# EasyEDA Pro project wireless charger controller.eprj, board 3代
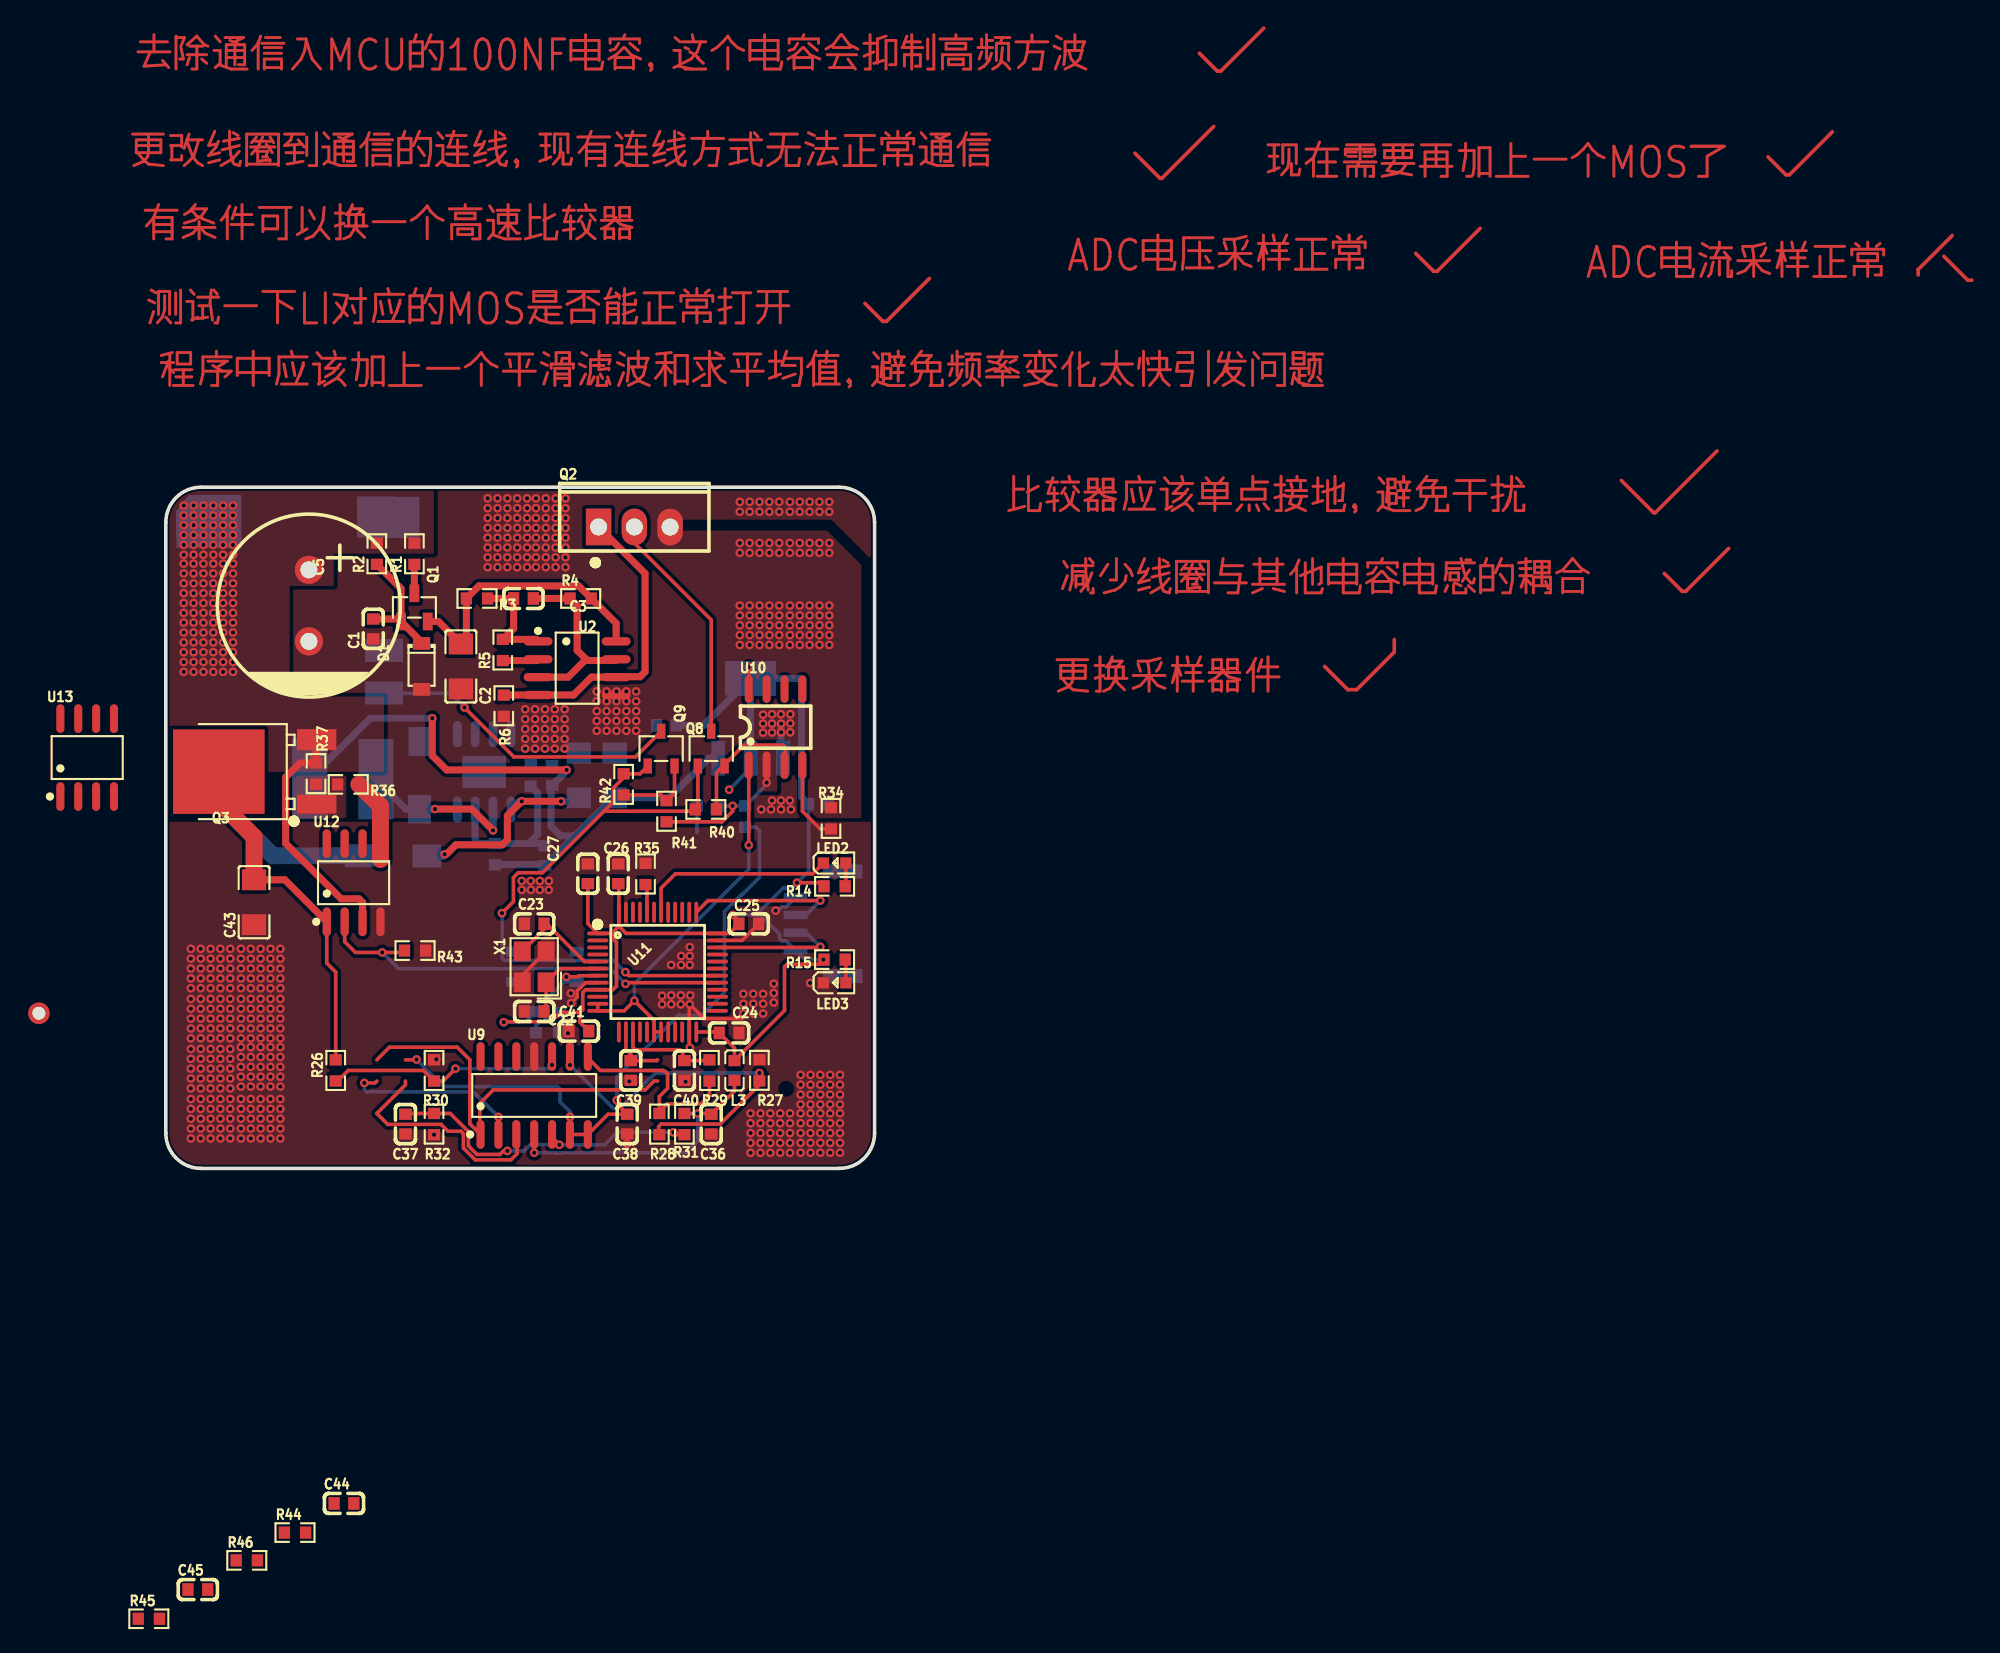
[diagram p8: board, top side]
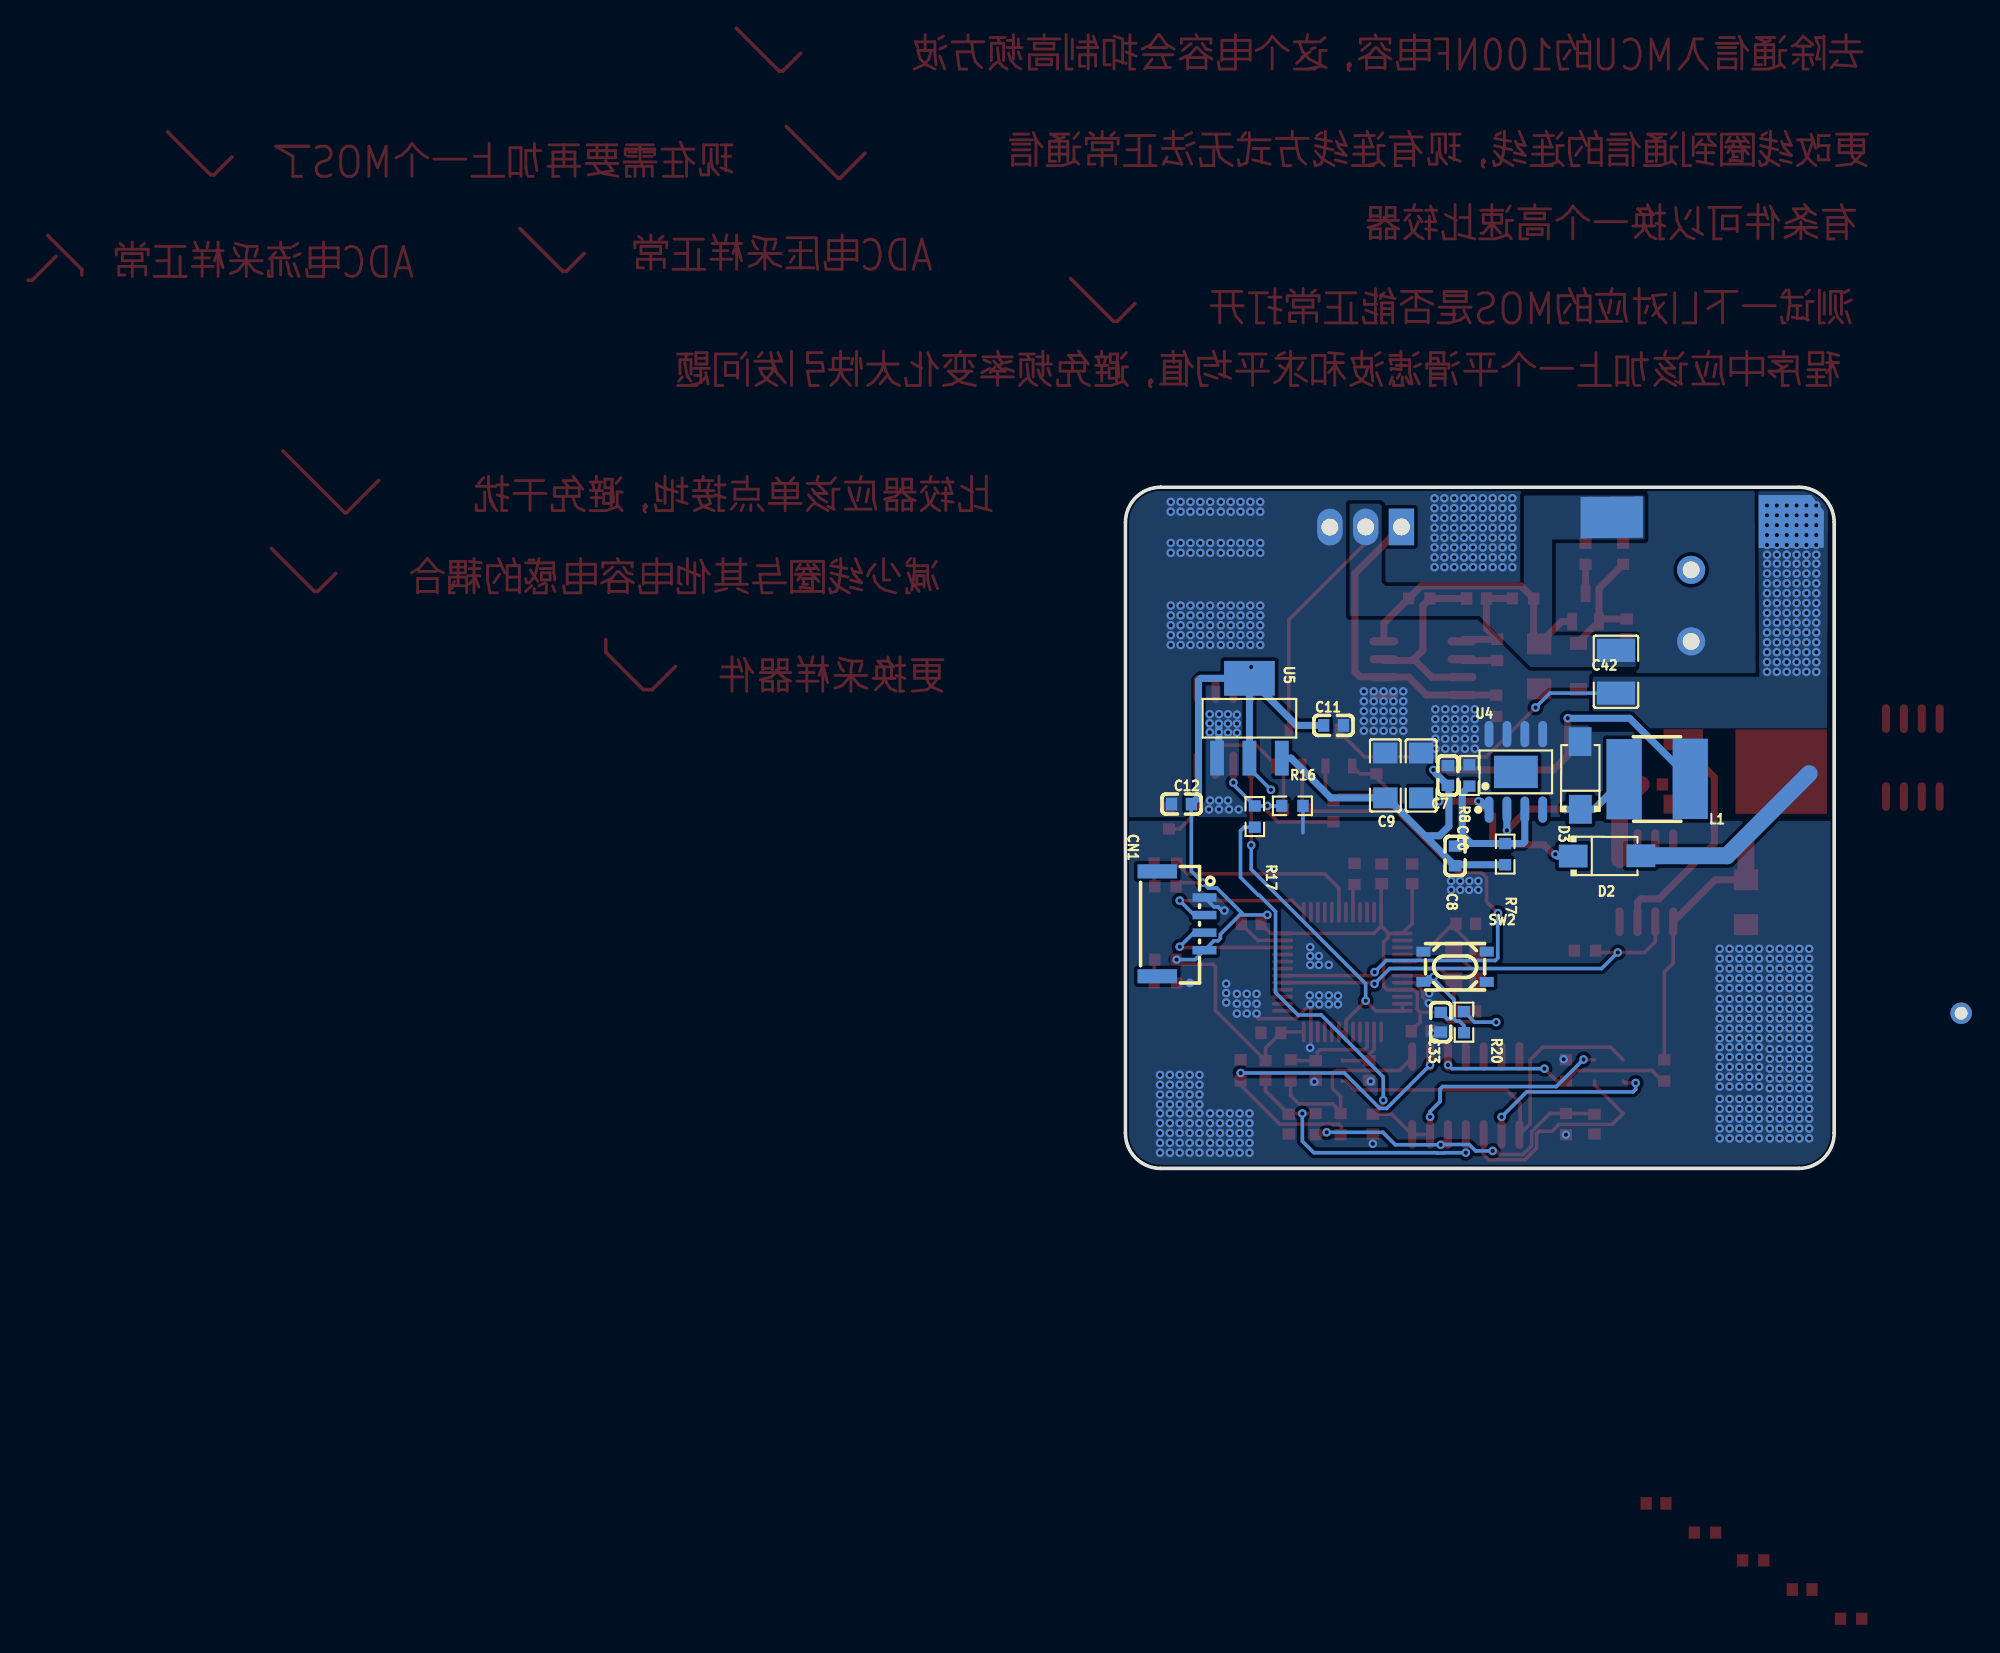
[diagram p9: board, bottom side, seen from below]

Outline 50.34 x 48.39 mm; copper layers: Top Layer, Bottom Layer. Coordinates in mm from the lower left corner of the outline.
Outline path: 0,45.89 0,2.5 arc(0.73,0.73) 2.5,0 47.84,0 arc(49.6,0.73) 50.34,2.5 50.34,45.89 arc(49.6,47.65) 47.84,48.39 2.5,48.39 arc(0.73,47.65) 0,45.89
Stack: Top Layer 0.035mm / Dielectric1 1.51mm FR4 er 4.5 / Bottom Layer 0.035mm

## Design rules (mm)
template: 自定义配置
spacing copperThickness1oz (default): track to track 0.102, other pairs 0.152 to 0.3
spacing copperThickness2oz: track to track 0.203, other pairs 0.152 to 0.3
track width copperThickness1oz (default): min 0.127, default 0.254, max 2.54
track width copperThickness2oz: min 0.203, default 0.254, max 2.54
differential pair differentialPair (default): width min 0.127, default 0.254, max 2.54; gap min 0.152, default 0.152
via viaSize (default): diameter min 0.5, default 0.61, max 10; hole min 0.3, default 0.305, max 6.3
net WGND uses copperRegion1
net +9.5V uses copperRegion1
net $1N7036 uses copperRegion1
net GND uses copperRegion1
net $1N7004 uses copperRegion1
net +36V uses copperRegion1
net GH uses copperRegion1
net HS uses copperRegion1
net INFORMATION+ uses copperRegion1
net $1N27675 uses copperRegion1
net LOAD- uses copperRegion1

## Placement (name value [footprint] x y rotation side)
C1  100nF  [C0603]  14.73 38.33 90 top
C2  47uF  [C1206]  20.95 35.66 90 top
C3  1nF  [C0603]  25.4 40.49 180 top
C5  1000uF  [CAP-TH_BD13.0-P5.00-D1.2-FD]  10.16 39.98 270 top
C7  10uF  [C1206]  29.34 27.91 270 bottom
C8  33nF  [C0603]  26.92 22.2 90 bottom
C9  47uF  [C1206]  31.88 27.91 90 bottom
C10  100nF  [C0603]  27.43 27.91 90 bottom
C11  10uF  [C0603]  35.56 31.47 180 bottom
C12  100nF  [C0603]  46.35 25.88 0 bottom
C22  22pF  [C0603]  26.16 11.15 180 top
C23  22pF  [C0603]  26.16 17.37 0 top
C24  100nF  [C0603]  40 9.62 0 top
C25  100nF  [C0603]  41.4 17.37 0 top
C26  100nF  [C0603]  32.13 20.93 90 top
C27  100nF  [C0603]  29.97 20.93 90 top
C33  100nF  [C0603]  27.94 10.39 90 bottom
C36  100nF  [C0603]  38.73 3.15 90 top
C37  100nF  [C0603]  17.02 3.15 90 top
C38  100nF  [C0603]  32.77 3.15 90 top
C39  10nF  [C0603]  33.02 6.96 90 top
C40  10nF  [C0603]  36.83 6.96 270 top
C41  100nF  [C0603]  29.34 9.75 0 top
C42  47nF  [C1210]  15.49 35.28 270 bottom
C43  10uF  [C1206]  6.26 18.91 90 top
C44  100nF  [C0603]  12.65 -23.8 0 top
C45  10nF  [C0603]  2.27 -29.92 0 top
CN1  ZX-BX-GH1.25-LT4  [CONN-SMD_ZX-BX-GH1.25-LT4]  46.4 17.37 270 bottom
D1  MMSZ5242B  [SOD-123_L2.7-W1.6-LS3.7-RD]  18.16 35.66 270 top
D2  SS510  [SMA_L4.3-W2.6-LS5.0-RD]  16.13 22.2 180 bottom
D3  SS510  [SMA_L4.3-W2.6-LS5.0-RD]  18.03 27.91 90 bottom
L1  100uH  [IND-SMD_L6.0-W6.0_FNR60XXS]  12.57 27.66 0 bottom
L3  10uH  [L0603]  40.39 6.96 90 top
LED2  NCD0603R1  [LED0603-RD_RED]  47.5 21.69 0 top
LED3  NCD0603R1  [LED0603-RD_RED]  47.5 13.18 0 top
NOREF  -  [Pad_e851]  3.05 45.95 0 top
NOREF#2  -  [Pad_e852]  15.8 46.25 0 top
NOREF#3  -  [Pad_e608]  3.05 45.96 0 top
NOREF#4  -  [Pad_e622]  -9.02 11.02 0 top
Q1  MMBT5551  [SOT-23-3_L2.9-W1.3-P1.90-LS2.4-BR]  17.65 39.85 270 top
Q2  -  [IRF9540P_TO-220]  33.27 45.57 0 top
Q3  NCEP0178AK  [TO-252-2_L6.5-W6.1-P4.58-LS10.0-TL]  7.24 28.17 180 top
Q8  G01N20LE  [SOT-23-3_L2.9-W1.6-P1.90-LS2.8-BR]  38.73 29.82 270 top
Q9  G01N20LE  [SOT-23-3_L2.9-W1.6-P1.90-LS2.8-BR]  35.18 29.82 270 top
R1  330Ω  [R0603]  17.65 43.66 90 top
R2  100kΩ  [R0603]  14.99 43.66 90 top
R3  47kΩ  [R0603]  22.1 40.49 180 top
R4  47kΩ  [R0603]  29.46 40.49 0 top
R5  3.9kΩ  [R0603]  23.93 36.83 90 top
R6  20kΩ  [R0603]  24 32.87 90 top
R7  30kΩ  [R0603]  23.37 22.32 90 bottom
R8  4.7kΩ  [R0603]  25.91 27.91 270 bottom
R14  1kΩ  [R0603]  47.5 20.04 180 top
R15  1kΩ  [R0603]  47.5 14.83 180 top
R16  0Ω  [R0603]  38.48 25.75 0 bottom
R17  0Ω  [R0603]  41.15 24.99 90 bottom
R20  10kΩ  [R0603]  26.29 10.39 90 bottom
R26  15kΩ  [R0603]  12.06 6.96 90 top
R27  15kΩ  [R0603]  42.16 6.97 90 top
R28  1kΩ  [R0603]  35.05 3.15 270 top
R29  1kΩ  [R0603]  38.61 6.96 90 top
R30  1kΩ  [R0603]  19.05 6.96 90 top
R31  10kΩ  [R0603]  36.83 3.15 270 top
R32  10kΩ  [R0603]  19.05 3.15 270 top
R34  0Ω  [R0603]  47.24 24.86 90 top
R35  10kΩ  [R0603]  34.07 20.91 90 top
R36  4.7Ω  [R0603]  12.95 27.28 180 top
R37  10kΩ  [R0603]  10.67 28.04 270 top
R40  10kΩ  [R0603]  38.35 25.5 180 top
R41  0Ω  [R0603]  35.56 25.37 270 top
R42  10kΩ  [R0603]  32.51 27.28 90 top
R43  10kΩ  [R0603]  17.7 15.47 180 top
R44  100Ω  [R0603]  9.17 -25.87 0 top
R45  100Ω  [R0603]  -1.21 -31.99 0 top
R46  10kΩ  [R0603]  5.75 -27.85 0 top
SW2  TS3425BA  [SW-SMD_4P-L4.2-W3.2-P2.15-LS4.6-1]  26.92 14.32 0 bottom
U2  LM2904DR2G  [SOIC-8_L4.9-W3.9-P1.27-LS6.0-BL]  29.21 35.53 270 top
U4  XL7005A  [SOIC-8_L4.9-W3.9-P1.27-LS6.0-BL-EP3.1-1]  22.61 28.17 180 bottom
U5  SPX1117M3-L-3-3/TR  [SOT-223-4_L6.5-W3.5-P2.30-LS7.0-BR]  41.53 31.98 270 bottom
U9  TLV2374IDR  [SOIC-14_L8.7-W3.9-P1.27-LS6.0-BL]  26.16 5.18 0 top
U10  LM393DR  [SOIC-8_L5.0-W4.0-P1.27-LS6.0-BL]  43.31 31.34 0 top
U11  STM32F103C8T6  [LQFP-48_L7.0-W7.0-P0.50-LS9.0-BL]  34.92 13.94 270 top
U12  MX5014S  [SOIC-8_L4.9-W3.9-P1.27-LS6.0-BL]  13.34 20.29 0 top
U13  CC6920BSO-10A  [SOP-8_L5.0-W4.0-P1.27-LS6.0-BL]  -5.59 29.18 0 top
X1  8MHz  [CRYSTAL-SMD_4P-L3.2-W2.5-BL]  26.16 14.32 90 top

## Footprints (pads in the part's own frame, mm; a bottom-side part is the same pattern mirrored in y, then rotated)
C0603
  rect 0.8x0.9 smd: 1(-0.7,0) 2(0.7,0)
C1206
  rect 1.485x1.728 smd: 1(-1.593,0) 2(1.593,0)
C1210
  rect 1.635x2.7 smd: 1(-1.518,0) 2(1.518,0)
CAP-TH_BD13.0-P5.00-D1.2-FD
  round 2 hole 1.2: 1(-2.54,0) 2(2.54,0)
CONN-SMD_ZX-BX-GH1.25-LT4
  rect 0.6x1.7 smd: 1(-1.875,1.675) 2(-0.625,1.675) 3(0.625,1.675) 4(1.875,1.675)
  rect 1x2.8 smd: 5(3.725,-1.675) 6(-3.725,-1.675)
CRYSTAL-SMD_4P-L3.2-W2.5-BL
  rect 1.4x1.2 smd: 1(-1.1,-0.85) 2(1.1,-0.85) 3(1.1,0.85) 4(-1.1,0.85)
IND-SMD_L6.0-W6.0_FNR60XXS
  rect 2.5x5.7 smd: 1(-2.35,-0.013) 2(2.35,0.013)
IRF9540P_TO-220
  rect 1.801x2.601 hole 1.199: 1(-2.54,0)
  oval 1.801x2.601 hole 1.199: 2(0,0) 3(2.54,-0.01)
L0603
  rect 0.8x0.864 smd: 1(-0.7,0) 2(0.7,0)
LED0603-RD_RED
  rect 0.8x0.8 smd: 1(-0.799,-0.004) 2(0.799,0.004)
LQFP-48_L7.0-W7.0-P0.50-LS9.0-BL
  oval 0.27x1.5 smd: 1(-2.75,-4.25) 2(-2.25,-4.25) 3(-1.75,-4.25) 4(-1.25,-4.25) 5(-0.75,-4.25) 6(-0.25,-4.25) 7(0.25,-4.25) 8(0.75,-4.25) 9(1.25,-4.25) 10(1.75,-4.25) 11(2.25,-4.25) 12(2.75,-4.25) 25(2.75,4.25) 26(2.25,4.25) 27(1.75,4.25) 28(1.25,4.25) 29(0.75,4.25) 30(0.25,4.25) 31(-0.25,4.25) 32(-0.75,4.25) 33(-1.25,4.25) 34(-1.75,4.25) 35(-2.25,4.25) 36(-2.75,4.25)
  oval 1.5x0.27 smd: 13(4.25,-2.75) 14(4.25,-2.25) 15(4.25,-1.75) 16(4.25,-1.25) 17(4.25,-0.75) 18(4.25,-0.25) 19(4.25,0.25) 20(4.25,0.75) 21(4.25,1.25) 22(4.25,1.75) 23(4.25,2.25) 24(4.25,2.75) 37(-4.25,2.75) 38(-4.25,2.25) 39(-4.25,1.75) 40(-4.25,1.25) 41(-4.25,0.75) 42(-4.25,0.25) 43(-4.25,-0.25) 44(-4.25,-0.75) 45(-4.25,-1.25) 46(-4.25,-1.75) 47(-4.25,-2.25) 48(-4.25,-2.75)
Pad_e608
  custom 4.61x3.735 smd far side: 1(0,0)
Pad_e622
  round 1.524 hole 0.914: 1(0,0)
Pad_e851
  custom 4.61x3.735 smd far side: 1(0,0)
Pad_e852
  custom 4.419x2.974 smd far side: 2(0,0)
R0603
  rect 0.806x0.864 smd: 1(-0.753,0) 2(0.753,0)
SMA_L4.3-W2.6-LS5.0-RD
  rect 2.046x1.62 smd: 1(-2.404,-0.009) 2(2.404,0.009)
SOD-123_L2.7-W1.6-LS3.7-RD
  rect 0.91x1.22 smd: 1(-1.635,0) 2(1.635,0)
SOIC-8_L4.9-W3.9-P1.27-LS6.0-BL
  oval 0.588x2.045 smd: 1(-1.905,-2.772) 2(-0.635,-2.772) 3(0.635,-2.772) 4(1.905,-2.772) 5(1.905,2.772) 6(0.635,2.772) 7(-0.635,2.772) 8(-1.905,2.772)
SOIC-8_L4.9-W3.9-P1.27-LS6.0-BL-EP3.1-1
  oval 0.63x1.865 smd: 1(-1.905,-2.683) 2(-0.635,-2.683) 3(0.635,-2.683) 4(1.905,-2.683) 5(1.905,2.683) 6(0.635,2.683) 7(-0.635,2.683) 8(-1.905,2.683)
  rect 3.1x2.3 smd: 9(0,0)
SOIC-8_L5.0-W4.0-P1.27-LS6.0-BL
  oval 0.569x1.95 smd: 1(-1.905,-2.705) 2(-0.635,-2.705) 3(0.635,-2.705) 4(1.905,-2.705) 5(1.905,2.705) 6(0.635,2.705) 7(-0.635,2.705) 8(-1.905,2.705)
SOIC-14_L8.7-W3.9-P1.27-LS6.0-BL
  oval 0.574x2.038 smd: 1(-3.81,-2.769) 2(-2.54,-2.769) 3(-1.27,-2.769) 4(0,-2.769) 5(1.27,-2.769) 6(2.54,-2.769) 7(3.81,-2.769) 8(3.81,2.769) 9(2.54,2.769) 10(1.27,2.769) 11(0,2.769) 12(-1.27,2.769) 13(-2.54,2.769) 14(-3.81,2.769)
SOP-8_L5.0-W4.0-P1.27-LS6.0-BL
  oval 0.574x2.035 smd: 1(-1.905,-2.768) 2(-0.635,-2.768) 3(0.635,-2.768) 4(1.905,-2.768) 5(1.905,2.768) 6(0.635,2.768) 7(-0.635,2.768) 8(-1.905,2.768)
SOT-23-3_L2.9-W1.3-P1.90-LS2.4-BR
  rect 1.25x0.7 smd: 1(1,-0.95) 2(1,0.95) 3(-1,0)
SOT-23-3_L2.9-W1.6-P1.90-LS2.8-BR
  rect 1.07x0.6 smd: 1(1.235,-0.95) 2(1.235,0.95) 3(-1.235,0)
SOT-223-4_L6.5-W3.5-P2.30-LS7.0-BR
  rect 2.47x0.98 smd: 1(2.835,-2.3) 2(2.835,0) 3(2.835,2.3)
  rect 2.47x3.6 smd: 4(-2.835,0)
SW-SMD_4P-L4.2-W3.2-P2.15-LS4.6-1
  rect 1x0.7 smd: 1(-2.25,1.075) 2(2.25,1.075) 3(-2.25,-1.075) 4(2.25,-1.075)
TO-252-2_L6.5-W6.1-P4.58-LS10.0-TL
  rect 2.8x1.35 smd: 1(-3.475,2.29)
  rect 2.8x1.5 smd: 3(-3.475,-2.29)
  rect 6.5x6 smd: 4(3.475,-0.017)

## Nets
As in the schematic, except:
HS: C5.1 C42.2 NOREF.1 NOREF#3.1 Q3.3 Q9.3 R1.2 R2.2 R37.1 U12.3
INFORMATION+: C42.1 NOREF#2.2 Q2.2 Q8.3

Pads without a net: CN1 5 6; NOREF#4 1; SW2 1 3; U4 4 9; U9 12 13 14; U10 5 6 7; U11 2 3 4 10 13 16 17 20 21 22 25 26 27 28 31 32 33 38 39 40 41 43 45 46; U12 6 7 8; U13 6

## Via types
v1: diameter 0.61, hole 0.305, Top Layer to Bottom Layer, 693 vias

## Routing (per net, layer and track width the routed paths; a pad name or vN(x,y) marks a point on that pad's centre or on a via; arc(x,y) is an arc through that point)
36V: length 40.2
  Top Layer w0.254: U12.1 11.43,14.58 12.06,13.94 12.06,7.71
  Top Layer w0.5: U12.1 8.45,20.5 C43.2
  Top Layer w1.2: 1.78,28.04 6.26,23.55 C43.2
  Bottom Layer w1.2: 1.78,28.04 7.61,22.21 D2.2
+1.65V: length 45.6
  Top Layer w0.254: v1(32.02,4.84) 32.02,4.59 C38.2 31.41,3.85 U9.7 U9.6 ; 17.02,7.71 17.78,7.71 v1(17.81,7.74)
  Bottom Layer w0.254: v1(28.7,3.66) 28.7,4.04 27.99,4.75 27.99,5.63 27.81,5.81 19.73,5.81 v1(17.81,7.74) ; v1(32.02,4.84) 32.02,6.5 36.42,10.89 38.07,10.89 39.67,12.5 39.67,18.25 40.83,19.4 40.89,19.4 42.16,20.67 42.16,23.98 41.9,24.24 R17.1
+3.3V: length 100.6
  Top Layer w0.254: 29.41,11.08 28.04,11.08 27.38,10.42 24.04,10.42 v1(24,10.39) ; 29.41,11.08 29.61,11.28 29.61,12.49 29.81,12.69 U11.9 31.75,12.69 32,12.95 32,16.06 31.67,16.4 31.67,16.69 ; 29.41,11.08 29.41,10.38 C41.2 ; R14.2 46.49,20.29 v1(44.83,20.29) ; C26.1 32.17,20.18 U11.48 32.17,17.2 ; 32.17,17.2 32.68,16.69 U11.36 40.02,16.69 C25.1 40.7,17.56 v1(40.26,18.01) ; 32.17,17.2 31.67,16.69 ; U11.24 39.24,9.69 C24.1 40.39,8.54 L3.2 43.94,11.21 43.94,14.32 44.12,14.5 46.42,14.5 R15.2 ; v1(41.4,35.62) U10.8 ; C27.1 29.97,17.4 U11.1 31.67,16.69
  Bottom Layer w0.254: R20.2 25.54,10.39 v1(24,10.39) ; 41.94,18.01 42.21,18.01 43.59,16.63 43.59,16.33 43.76,16.17 44.05,16.17 CN1.4 45.39,14.83 v1(46.7,14.83) ; 41.94,18.01 v1(40.26,18.01) ; 41.94,18.01 43.84,19.91 44.45,19.91 v1(44.83,20.29) 45.66,21.12 C12.1 ; v1(40,26.9) 41.53,28.42 U5.2
  Bottom Layer w0.5: C12.1 45.15,26.39 45.15,34.64 44.98,34.81 U5.4 ; U5.4 38.19,31.47 C11.1 ; U5.4 U5.2
+9.5V: length 48.6
  Top Layer w0.5: v1(28.47,28.31) 19.94,28.31 18.92,29.33 v1(18.92,31.98)
  Bottom Layer w0.5: v1(18.92,31.98) 14.53,31.98 L1.1 ; 29.06,23.63 31.75,26.32 35.75,26.32 38.57,29.14 U5.3 ; 29.06,23.63 28.03,23.63 27.36,24.3 27.36,27.14 C10.1 27.62,27.4 27.64,27.4 28.28,28.05 28.28,28.12 v1(28.47,28.31) ; 29.06,23.63 27.78,22.35 27.78,22.33 26.94,21.5 C8.1 26.85,21.57 R7.1
GND: length 27.1
  Top Layer w0.254: 41.07,11 40.89,10.82 40.89,10.64 38.23,10.64 v1(37.21,11.66) 37.17,11.62 U11.23 37.17,8.62 v1(37.22,8.57) ; C39.1 32.95,6.18 v1(32.92,6.18) ; C38.1 v1(32.77,1.75) ; U11.8 29.81,13.19 29.21,12.6 29.21,12.17 v1(28.78,11.74) ; U11.35 40.92,16.19 C25.2 ; X1.2 25.31,13.72 X1.4 ; R34.1 46.47,24.11 45.21,25.37 U10.4
  Bottom Layer w0.254: v1(43.31,18.31) 43.49,18.31 43.76,18.58 44.05,18.58 CN1.1 ; 37.73,23.85 R16.1
  vias: v1(1.77,15.6) v1(1.77,14.9) v1(1.77,14.2) v1(1.77,13.5) v1(1.77,12.8) v1(1.77,12.04) v1(1.77,11.34) v1(1.77,10.64) v1(1.77,9.94) v1(1.77,9.24) v1(1.77,8.48) v1(1.77,7.78) v1(1.77,7.08) v1(1.77,6.38) v1(1.77,5.68) v1(1.77,4.93) v1(1.77,4.23) v1(1.77,3.53) v1(1.77,2.83) v1(1.77,2.13) v1(2.47,15.6) v1(2.47,14.9) v1(2.47,14.2) v1(2.47,13.5) v1(2.47,12.8) v1(2.47,12.04) v1(2.47,11.34) v1(2.47,10.64) v1(2.47,9.94) v1(2.47,9.24) v1(2.47,8.48) v1(2.47,7.78) v1(2.47,7.08) v1(2.47,6.38) v1(2.47,5.68) v1(2.47,4.93) v1(2.47,4.23) v1(2.47,3.53) v1(2.47,2.83) v1(2.47,2.13) v1(3.17,15.6) v1(3.17,14.9) v1(3.17,14.2) v1(3.17,13.5) v1(3.17,12.8) v1(3.17,12.04) v1(3.17,11.34) v1(3.17,10.64) v1(3.17,9.94) v1(3.17,9.24) v1(3.17,8.48) v1(3.17,7.78) v1(3.17,7.08) v1(3.17,6.38) v1(3.17,5.68) v1(3.17,4.93) v1(3.17,4.23) v1(3.17,3.53) v1(3.17,2.83) v1(3.17,2.13) v1(3.88,15.6) v1(3.88,14.9) v1(3.88,14.2) v1(3.88,13.5) v1(3.88,12.8) v1(3.88,12.04) v1(3.88,11.34) v1(3.88,10.64) v1(3.88,9.94) v1(3.88,9.24) v1(3.88,8.48) v1(3.88,7.78) v1(3.88,7.08) v1(3.88,6.38) v1(3.88,5.68) v1(3.88,4.93) v1(3.88,4.23) v1(3.88,3.53) v1(3.88,2.83) v1(3.88,2.13) v1(4.57,15.6) v1(4.57,14.9) v1(4.57,14.2) v1(4.57,13.5) v1(4.57,12.8) v1(4.57,12.04) v1(4.57,11.34) v1(4.57,10.64) v1(4.57,9.94) v1(4.57,9.24) v1(4.57,8.48) v1(4.57,7.78) v1(4.57,7.08) v1(4.57,6.38) v1(4.57,5.68) v1(4.57,4.93) v1(4.57,4.23) v1(4.57,3.53) v1(4.57,2.83) v1(4.57,2.13) v1(5.33,15.6) v1(5.33,14.9) v1(5.33,14.2) v1(5.33,13.5) v1(5.33,12.8) v1(5.33,12.04) v1(5.33,11.34) v1(5.33,10.64) v1(5.33,9.94) v1(5.33,9.24) v1(5.33,8.61) v1(5.33,7.91) v1(5.33,7.21) v1(5.33,6.51) v1(5.33,5.81) v1(5.33,4.93) v1(5.33,4.23) v1(5.33,3.53) v1(5.33,2.83) v1(5.33,2.13) v1(6.03,15.6) v1(6.03,14.9) v1(6.03,14.2) v1(6.03,13.5) v1(6.03,12.8) v1(6.03,12.04) v1(6.03,11.34) v1(6.03,10.64) v1(6.03,9.94) v1(6.03,9.24) v1(6.03,8.61) v1(6.03,7.91) v1(6.03,7.21) v1(6.03,6.51) v1(6.03,5.81) v1(6.03,4.93) v1(6.03,4.23) v1(6.03,3.53) v1(6.03,2.83) v1(6.03,2.13) v1(6.73,15.6) v1(6.73,14.9) v1(6.73,14.2) v1(6.73,13.5) v1(6.73,12.8) v1(6.73,12.04) v1(6.73,11.34) v1(6.73,10.64) v1(6.73,9.94) v1(6.73,9.24) v1(6.73,8.61) v1(6.73,7.91) v1(6.73,7.21) v1(6.73,6.51) v1(6.73,5.81) v1(6.73,4.93) v1(6.73,4.23) v1(6.73,3.53) v1(6.73,2.83) v1(6.73,2.13) v1(7.43,15.6) v1(7.43,14.9) v1(7.43,14.2) v1(7.43,13.5) v1(7.43,12.8) v1(7.43,12.04) v1(7.43,11.34) v1(7.43,10.64) v1(7.43,9.94) v1(7.43,9.24) v1(7.43,8.61) v1(7.43,7.91) v1(7.43,7.21) v1(7.43,6.51) v1(7.43,5.81) v1(7.43,4.93) v1(7.43,4.23) v1(7.43,3.53) v1(7.43,2.83) v1(7.43,2.13) v1(8.13,15.6) v1(8.13,14.9) v1(8.13,14.2) v1(8.13,13.5) v1(8.13,12.8) v1(8.13,12.04) v1(8.13,11.34) v1(8.13,10.64) v1(8.13,9.94) v1(8.13,9.24) v1(8.13,8.61) v1(8.13,7.91) v1(8.13,7.21) v1(8.13,6.51) v1(8.13,5.81) v1(8.13,4.93) v1(8.13,4.23) v1(8.13,3.53) v1(8.13,2.83) v1(8.13,2.13) v1(19.05,2.39) v1(19.21,7.75) v1(25.27,20.42) v1(25.27,19.78) v1(25.91,20.42) v1(25.92,19.78) v1(26.56,20.42) v1(26.56,19.78) v1(27.21,20.42) v1(27.2,19.78) v1(28.56,9.6) v1(28.76,12.44) v1(35.24,12.26) v1(35.24,11.66) v1(35.89,14.45) v1(35.89,12.29) v1(35.89,11.66) v1(36.6,15.09) v1(36.59,14.45) v1(36.58,12.29) v1(36.58,11.66) v1(36.92,6.16) v1(37.21,15.72) v1(37.21,15.09) v1(37.21,14.45) v1(37.24,12.29) v1(41.02,12.4) v1(41.02,11.7) v1(41.02,11) v1(41.53,3.91) v1(41.53,3.21) v1(41.53,2.51) v1(41.53,1.81) v1(41.53,1.11) v1(41.72,12.4) v1(41.72,11.7) v1(41.72,11) v1(42.23,3.91) v1(42.23,3.21) v1(42.23,2.51) v1(42.23,1.81) v1(42.23,1.11) v1(42.42,12.4) v1(42.42,11.7) v1(42.42,11) v1(42.93,3.91) v1(42.93,3.21) v1(42.93,2.51) v1(42.93,1.81) v1(42.93,1.11) v1(43.18,13.12) v1(43.18,12.46) v1(43.18,11.78) v1(43.63,3.91) v1(43.63,3.21) v1(43.63,2.51) v1(43.63,1.81) v1(43.63,1.11) v1(44.33,3.91) v1(44.33,3.21) v1(44.33,2.51) v1(44.33,1.81) v1(44.33,1.11) v1(45.08,6.64) v1(45.08,5.94) v1(45.08,5.24) v1(45.08,4.54) v1(45.08,3.91) v1(45.08,3.21) v1(45.08,2.51) v1(45.08,1.81) v1(45.08,1.11) v1(45.76,13.17) v1(45.78,6.64) v1(45.78,5.94) v1(45.78,5.24) v1(45.78,4.54) v1(45.78,3.91) v1(45.78,3.21) v1(45.78,2.51) v1(45.78,1.81) v1(45.78,1.11) v1(46.48,6.64) v1(46.48,5.94) v1(46.48,5.24) v1(46.48,4.54) v1(46.48,3.91) v1(46.48,3.21) v1(46.48,2.51) v1(46.48,1.81) v1(46.48,1.11) v1(47.18,6.64) v1(47.18,5.94) v1(47.18,5.24) v1(47.18,4.54) v1(47.18,3.91) v1(47.18,3.21) v1(47.18,2.51) v1(47.18,1.81) v1(47.18,1.11) v1(47.88,6.64) v1(47.88,5.94) v1(47.88,5.24) v1(47.88,4.54) v1(47.88,3.91) v1(47.88,3.21) v1(47.88,2.51) v1(47.88,1.81) v1(47.88,1.11)
(no net): length 63.3
  Top Layer w0.254: 106.43,42.26 107.7,40.99 107.95,40.99 111,44.04 ; 73.41,79.22 74.68,77.95 74.93,77.95 77.98,81 ; 103.38,48.87 105.66,46.58 105.79,46.58 110.17,50.96 ; 87.25,37.56 87.25,36.68 84.58,34.01 83.95,34.01 82.3,35.66 ; 88.77,65 90.04,63.73 90.3,63.73 93.34,66.77 ; 126.87,66.27 124.46,63.85 124.46,63.47 ; 128.27,63.09 127.98,63.09 126.28,64.79 ; 113.79,71.85 115.06,70.58 115.32,70.58 118.36,73.63 ; 49.66,61.44 50.93,60.17 51.18,60.17 54.23,63.22 ; 74.42,74.01 70.74,70.33 70.61,70.33 68.83,72.11
BOOT0: length 2
  Top Layer w0.254: R35.1 34.17,20.05 U11.44
GH: length 6
  Top Layer w1.2: R36.1 15.24,25.74 U12.5 15.24,21.94
HS: length 39.8
  Top Layer w0.254: Q9.3 33.36,29.23 24.72,29.23 v1(21.21,32.74)
  Top Layer w0.5: Q3.3 10.67,30.41 R37.1 9.52,28.79 8.51,27.79 8.51,23.09 12.45,19.15 13.72,19.15 13.97,18.9 U12.3
  Bottom Layer w0.254: C42.2 20.19,33.76 v1(21.21,32.74)
  vias: v1(1.27,47.09) v1(1.27,46.39) v1(1.27,45.69) v1(1.27,44.99) v1(1.27,44.29) v1(1.27,43.59) v1(1.27,42.96) v1(1.27,42.26) v1(1.27,41.56) v1(1.27,40.86) v1(1.27,40.16) v1(1.27,39.46) v1(1.27,38.77) v1(1.27,38.07) v1(1.27,37.37) v1(1.27,36.67) v1(1.27,35.97) v1(1.27,35.27) v1(1.97,47.09) v1(1.97,46.39) v1(1.97,45.69) v1(1.97,44.99) v1(1.97,44.29) v1(1.97,43.59) v1(1.97,42.96) v1(1.97,42.26) v1(1.97,41.56) v1(1.97,40.86) v1(1.97,40.16) v1(1.97,39.46) v1(1.97,38.77) v1(1.97,38.07) v1(1.97,37.37) v1(1.97,36.67) v1(1.97,35.97) v1(1.97,35.27) v1(2.67,47.09) v1(2.67,46.39) v1(2.67,45.69) v1(2.67,44.99) v1(2.67,44.29) v1(2.67,43.59) v1(2.67,42.96) v1(2.67,42.26) v1(2.67,41.56) v1(2.67,40.86) v1(2.67,40.16) v1(2.67,39.46) v1(2.67,38.77) v1(2.67,38.07) v1(2.67,37.37) v1(2.67,36.67) v1(2.67,35.97) v1(2.67,35.27) v1(3.37,47.09) v1(3.37,46.39) v1(3.37,45.69) v1(3.37,44.99) v1(3.37,44.29) v1(3.37,43.59) v1(3.37,42.96) v1(3.37,42.26) v1(3.37,41.56) v1(3.37,40.86) v1(3.37,40.16) v1(3.37,39.46) v1(3.37,38.77) v1(3.37,38.07) v1(3.37,37.37) v1(3.37,36.67) v1(3.37,35.97) v1(3.37,35.27) v1(4.07,47.09) v1(4.07,46.39) v1(4.07,45.69) v1(4.07,44.99) v1(4.07,44.29) v1(4.07,43.59) v1(4.07,42.96) v1(4.07,42.26) v1(4.07,41.56) v1(4.07,40.86) v1(4.07,40.16) v1(4.07,39.46) v1(4.07,38.77) v1(4.07,38.07) v1(4.07,37.37) v1(4.07,36.67) v1(4.07,35.97) v1(4.07,35.27) v1(4.77,47.09) v1(4.77,46.39) v1(4.77,45.69) v1(4.77,44.99) v1(4.77,44.29) v1(4.77,43.59) v1(4.77,42.96) v1(4.77,42.26) v1(4.77,41.56) v1(4.77,40.86) v1(4.77,40.16) v1(4.77,39.46) v1(4.77,38.77) v1(4.77,38.07) v1(4.77,37.37) v1(4.77,36.67) v1(4.77,35.97) v1(4.77,35.27)
I_DETC: length 4.1
  Top Layer w0.254: U11.14 32.67,8.45 33.02,8.1 C39.2 34.87,7.66 34.92,7.71
INFORMATION+: length 17.1
  Top Layer w0.254: Q2.2 33.27,44.42 38.73,38.96 38.73,30.69
MCUIN: length 26.8
  Top Layer w0.254: v1(41.4,22.96) U10.1 ; U11.11 U11.12 32.56,11.19 v1(33.27,11.91) 34.67,10.51 U11.18 U11.19
  Bottom Layer w0.254: v1(33.27,11.91) 33.27,13.12 41.4,21.25 v1(41.4,22.96)
NET1: length 9
  Top Layer w0.5: C1.2 16.53,39.03 Q1.1 ; Q1.1 16.7,41.19 R2.1 ; Q1.1 18.16,37.39 D1.1
NET2: length 19.8
  Top Layer w0.5: U2.8 31.98,38.72 R4.2 29.33,41.37 22.23,41.37 R3.2 21.34,37.64 C2.2 19.36,38.85 Q1.2
NET3: length 2.1
  Top Layer w0.5: Q1.3 R1.1
OSCIN: length 7.5
  Top Layer w0.254: U11.5 29.73,14.69 27.05,17.37 C23.2 26.86,16.97 X1.3
OSCOUT: length 6.2
  Top Layer w0.254: C22.1 27.01,11.3 X1.1 27.98,14.19 U11.6
PA8(HI): length 30.8
  Top Layer w0.254: R43.2 16.81,15.34 v1(15.37,15.34) 13.46,15.34 12.7,16.1 U12.2 ; U11.29 32.73,13.19 v1(32.65,13.11)
  Bottom Layer w0.254: v1(32.65,13.11) 31.56,14.2 16.51,14.2 v1(15.37,15.34)
PA9(LI): length 44.8
  Top Layer w0.254: v1(32.64,13.94) 32.89,13.69 U11.30 ; v1(23.88,18.13) 24.69,18.95 24.69,20.66 25.03,21 26.75,21 31.12,25.37 ; Q8.1 37.78,25.68 R40.2 ; 31.12,25.37 31.8,26.06 31.8,27.04 32.51,27.75 R42.2 33.68,28.03 Q9.1 ; 31.12,25.37 37.35,25.37
  Bottom Layer w0.254: v1(32.64,13.94) 31.81,14.77 24.06,14.77 23.9,14.93 23.9,18.11 v1(23.88,18.13)
PB6: length 14
  Top Layer w0.254: LED2.1 45.94,20.93 36.19,20.93 35.17,19.91 U11.42
REF_3.3: length 20.3
  Top Layer w0.254: U9.4 v1(26.16,1.11) ; R31.1 v1(37.77,3.9) 38.68,3.9 C36.2 40.39,5.5 L3.1
  Bottom Layer w0.254: v1(37.77,3.9) 37.77,1.93 36.95,1.11 28.21,1.11 28.19,1.09 27.7,1.09 27.68,1.11 v1(26.16,1.11)
RESET: length 10
  Top Layer w0.254: U11.7 30.67,13.69 29.34,13.69 29.26,13.61 v1(28.45,13.61)
  Bottom Layer w0.254: 29.46,13.26 29.17,13.26 ; 29.17,13.26 28.27,13.26 27,11.99 27,10.62 ; 29.17,13.26 SW2.2 ; 29.17,13.26 28.81,13.61 v1(28.45,13.61) ; 27,10.62 26.84,10.46 26.61,10.46 26.29,10.14 R20.1 ; 27,10.62 27.47,10.62 C33.2
SWCLK(PA14): length 11.3
  Top Layer w0.254: v1(46.48,19.02) 38.5,19.02 U11.37
  Bottom Layer w0.254: CN1.2 45.46,18 v1(46.48,19.02)
SWDIO(PA13): length 9.5
  Top Layer w0.254: U11.34 46.43,15.69 v1(46.48,15.74)
  Bottom Layer w0.254: CN1.3 45.48,16.75 v1(46.48,15.74)
V_DETC: length 7.2
  Top Layer w0.254: R29.2 38.55,7.66 C40.1 36.7,7.78 36.7,8.25 36.52,8.43 33.35,8.43 33.17,8.61 U11.15
WGND: length 2.5
  Bottom Layer w0.5: v1(43.7,31.6) v1(43.7,30.98) 43.7,29.27 U5.1
  vias: v1(22.86,47.6) v1(22.86,46.9) v1(22.86,46.2) v1(22.86,45.5) v1(22.86,44.8) v1(22.85,44.11) v1(22.85,43.41) v1(22.85,42.71) v1(23.56,47.6) v1(23.56,46.9) v1(23.56,46.2) v1(23.56,45.5) v1(23.56,44.8) v1(23.55,44.11) v1(23.55,43.41) v1(23.55,42.71) v1(24.26,47.6) v1(24.26,46.9) v1(24.26,46.2) v1(24.26,45.5) v1(24.26,44.8) v1(24.25,44.11) v1(24.25,43.41) v1(24.25,42.71) v1(24.96,47.6) v1(24.96,46.9) v1(24.96,46.2) v1(24.96,45.5) v1(24.96,44.8) v1(24.95,44.11) v1(24.95,43.41) v1(24.95,42.71) v1(25.52,32.61) v1(25.52,31.91) v1(25.52,31.21) v1(25.52,30.51) v1(25.52,29.81) v1(25.66,47.6) v1(25.66,46.9) v1(25.66,46.2) v1(25.66,45.5) v1(25.66,44.8) v1(25.65,44.11) v1(25.65,43.41) v1(25.65,42.71) v1(26.29,47.6) v1(26.29,46.9) v1(26.29,46.2) v1(26.29,45.5) v1(26.29,44.8) v1(26.28,44.11) v1(26.28,43.41) v1(26.28,42.71) v1(26.22,32.61) v1(26.22,31.91) v1(26.22,31.21) v1(26.22,30.51) v1(26.22,29.81) v1(26.99,47.6) v1(26.99,46.9) v1(26.99,46.2) v1(26.99,45.5) v1(26.99,44.8) v1(26.98,44.11) v1(26.98,43.41) v1(26.98,42.71) v1(26.92,32.61) v1(26.92,31.91) v1(26.92,31.21) v1(26.92,30.51) v1(26.92,29.81) v1(27.69,47.6) v1(27.69,46.9) v1(27.69,46.2) v1(27.69,45.5) v1(27.69,44.8) v1(27.68,44.11) v1(27.68,43.41) v1(27.68,42.71) v1(27.62,32.61) v1(27.62,31.91) v1(27.62,31.21) v1(27.62,30.51) v1(27.62,29.81) v1(28.39,47.6) v1(28.39,46.9) v1(28.39,46.2) v1(28.39,45.5) v1(28.39,44.8) v1(28.38,44.11) v1(28.38,43.41) v1(28.38,42.71) v1(28.32,32.61) v1(28.32,31.91) v1(28.32,31.21) v1(28.32,30.51) v1(28.32,29.81) v1(30.6,33.88) v1(30.6,33.18) v1(30.6,32.48) v1(30.6,31.78) v1(30.6,31.08) v1(31.3,33.88) v1(31.3,33.18) v1(31.3,32.48) v1(31.3,31.78) v1(31.3,31.08) v1(32,33.88) v1(32,33.18) v1(32,32.48) v1(32,31.78) v1(32,31.08) v1(32.7,33.88) v1(32.7,33.18) v1(32.7,32.48) v1(32.7,31.78) v1(32.7,31.08) v1(33.4,33.88) v1(33.4,33.18) v1(33.4,32.48) v1(33.4,31.78) v1(33.4,31.08) v1(40.76,47.35) v1(40.76,46.65) v1(40.76,44.43) v1(40.76,43.73) v1(40.76,39.98) v1(40.76,39.28) v1(40.76,38.58) v1(40.76,37.88) v1(40.76,37.18) v1(41.46,47.35) v1(41.46,46.65) v1(41.46,44.43) v1(41.46,43.73) v1(41.46,39.98) v1(41.46,39.28) v1(41.46,38.58) v1(41.46,37.88) v1(41.46,37.18) v1(42.16,47.35) v1(42.16,46.65) v1(42.16,44.43) v1(42.16,43.73) v1(42.16,39.98) v1(42.16,39.28) v1(42.16,38.58) v1(42.16,37.88) v1(42.16,37.18) v1(42.29,25.5) v1(42.42,32.23) v1(42.42,31.6) v1(42.42,30.95) v1(42.86,47.35) v1(42.86,46.65) v1(42.86,44.43) v1(42.86,43.73) v1(42.86,39.98) v1(42.86,39.28) v1(42.86,38.58) v1(42.86,37.88) v1(42.86,37.18) v1(42.98,25.5) v1(43.05,32.26) v1(43.05,31.6) v1(43.05,30.96) v1(43.05,26.13) v1(43.56,47.35) v1(43.56,46.65) v1(43.56,44.43) v1(43.56,43.73) v1(43.56,39.98) v1(43.56,39.28) v1(43.56,38.58) v1(43.56,37.88) v1(43.56,37.18) v1(43.68,32.26) v1(43.69,26.13) v1(43.69,25.5) v1(44.32,47.35) v1(44.32,46.65) v1(44.32,44.43) v1(44.32,43.73) v1(44.32,39.98) v1(44.32,39.28) v1(44.32,38.58) v1(44.32,37.88) v1(44.32,37.18) v1(44.35,32.26) v1(44.35,31.62) v1(44.34,30.98) v1(44.32,26.13) v1(44.4,25.5) v1(45.02,47.35) v1(45.02,46.65) v1(45.02,44.43) v1(45.02,43.73) v1(45.02,39.98) v1(45.02,39.28) v1(45.02,38.58) v1(45.02,37.88) v1(45.02,37.18) v1(45.72,47.35) v1(45.72,46.65) v1(45.72,44.43) v1(45.72,43.73) v1(45.72,39.98) v1(45.72,39.28) v1(45.72,38.58) v1(45.72,37.88) v1(45.72,37.18) v1(46.42,47.35) v1(46.42,46.65) v1(46.42,44.43) v1(46.42,43.73) v1(46.42,39.98) v1(46.42,39.28) v1(46.42,38.58) v1(46.42,37.88) v1(46.42,37.18) v1(47.12,47.35) v1(47.12,46.65) v1(47.12,44.43) v1(47.12,43.73) v1(47.12,39.98) v1(47.12,39.28) v1(47.12,38.58) v1(47.12,37.88) v1(47.12,37.18)
$1N6946: length 13.5
  Top Layer w0.5: 29.84,36.17 29.93,36.08 31.89,36.08 U2.7 ; 29.84,36.17 29.21,36.8 29.21,39.99 R4.1 C3.1 ; 29.84,36.17 28.57,34.9 U2.3
$1N6947: length 7.6
  Top Layer w0.5: U2.1 26.29,37.58 R5.2 24.7,38.35 C3.2 R3.1
$1N6948: length 2.5
  Top Layer w0.5: R5.1 26.34,36.07 U2.2
$1N6979: length 1.7
  Top Layer w0.254: R15.1 48.3,14.79 LED3.2
$1N7002: length 14.3
  Top Layer w0.5: 19.94,22.32 20.6,22.99 23.9,22.99 24.26,23.34 24.26,25.06 v1(25.27,26.08) v1(28.07,26.08)
  Bottom Layer w0.5: U4.1 25.1,26.08 v1(25.27,26.08) ; v1(19.8,22.31) 19.68,22.19 D2.1 ; 29.21,26.32 28.97,26.08 v1(28.07,26.08)
$1N7004: length 11.3
  Top Layer w0.5: v1(19.11,25.53) 21.73,25.53 v1(23.24,24.01)
  Bottom Layer w0.5: v1(19.11,25.53) 19.09,25.51 D3.1 17.06,25.51 L1.2 ; U4.2 v1(23.24,24.01)
$1N7036: length 10.7
  Top Layer w0.254: R41.2 39.51,24.62 40.26,25.37 v1(40.26,25.75) ; U10.2 v1(42.67,27.4)
  Bottom Layer w0.254: 39.37,25.74 R17.2 42.67,27.27 v1(42.67,27.4)
$1N7060: length 1.7
  Top Layer w0.254: R14.1 48.3,20.08 LED2.2
$1N7082: length 9.5
  Top Layer w0.254: U10.3 43.99,28.69 43.99,29.89 43.81,30.07 41.07,30.07 39.11,28.11 39.11,25.63
$1N8055: length 23.3
  Top Layer w0.254: v1(24.26,1.24) 23.99,1.24 23.73,0.99 22.1,0.99 21.49,1.6 21.49,2.61 20.2,3.9 R32.1 17.07,3.9 C37.2 ; v1(36.04,2.56) 36.21,2.39 R31.2 ; v1(27.95,1.67) 27.43,2.19 U9.5
  Bottom Layer w0.254: v1(24.26,1.24) 25.47,1.24 25.92,1.7 27.92,1.7 v1(27.95,1.67) 31.17,1.67 32.06,2.56 v1(36.04,2.56)
$1N8063: length 16.6
  Top Layer w0.254: 17.02,6.2 17.02,5.93 14.99,3.9 15.76,3.13 19.55,3.13 20.03,2.64 20.95,2.64 21.13,2.46 21.13,1.44 21.97,0.61 24.51,0.61 24.94,1.04 24.94,2.36 U9.3
$1N8064: length 28.4
  Top Layer w0.254: 22.3,2.46 U9.1 ; 22.3,2.46 22.3,4.62 23.26,5.58 34.05,5.58 34.67,6.2 34.92,6.2 ; 22.3,2.46 21.59,3.17 21.59,7.72 20.7,8.61 15.88,8.61 14.99,7.71
$1N8072: length 25
  Top Layer w0.254: R27.1 42.16,5.93 39.37,3.15 35.18,3.15 35,2.97 35,2.47 34.92,2.39
  Bottom Layer w0.254: v1(42.16,6.78) 34.78,6.78 32.26,4.26 31.78,4.26 31.44,4.6 v1(28.7,7.34)
$1N8073: length 17.1
  Top Layer w0.254: v1(27.42,7.35) 27.42,7.94 U9.10 ; v1(20.57,7.08) 19.69,6.2 R30.1 18.3,6.96 12.95,6.96 12.2,6.2 R26.1
  Bottom Layer w0.254: v1(20.57,7.08) 27.16,7.08 v1(27.42,7.35)
$1N8078: length 14.4
  Top Layer w0.254: 35.05,4.03 35.05,5.1 35.64,5.69 35.64,6.72 35.47,6.89 35.38,6.89 35.31,6.96 30.86,6.96 29.97,7.85 U9.8 ; 35.05,4.03 R28.1 ; 35.05,4.03 35.61,4.58 38.01,4.58 38.61,5.18 R29.1
$1N17627: length 11.9
  Bottom Layer w0.5: C8.2 26.74,23.08 25.77,23.08 ; 25.77,23.08 26.42,23.72 26.42,26.65 R8.2 ; 25.77,23.08 R7.2 22.11,23.08 21.97,23.21 U4.3
$1N22600: length 22.4
  Top Layer w0.5: Q2.1 34.04,42.26 34.04,35.28 33.68,34.92 32.01,34.92 U2.6 30.23,34.9 28.96,33.63 U2.4 24.01,33.63 R6.2
$1N45503: length 5.9
  Top Layer w0.254: R42.1 35.16,26.52 R41.1 36.13,26.69 Q9.2
$1N55790: length 13
  Top Layer w0.254: v1(14.1,6.07) 14.85,6.07 14.99,6.2 ; 23.62,2.41 v1(23.62,3.66)
  Bottom Layer w0.254: v1(23.62,3.66) 21.84,5.43 14.28,5.43 14.1,5.61 v1(14.1,6.07)

## Copper pours and planes (outline as drawn; the poured copper is in the pictures)
GND on Top Layer: 0.13,24.62 50.34,24.62 50.34,0 0.13,0
GND on Bottom Layer: 0.25,24.69 50.34,24.69 50.34,0 0.25,0
HS on Top Layer: 0.25,28.17 15.49,28.17 15.49,33.52 8.79,33.52 8.79,41.37 11.94,41.37 11.94,43.66 19.04,43.66 19.04,48.99 0.25,48.99
HS on Bottom Layer: 0.51,31.26 17.15,31.26 17.15,34.93 5.32,34.93 5.4,48.11 0.44,48.11
INFORMATION+ on Bottom Layer: 14.09,35.62 21.58,35.62 25.2,39.24 34.42,39.24 34.42,47.22 32.26,47.22 32.13,47.09 32.13,41.63 31.88,41.37 22.04,41.37 22.04,47.8 13.46,47.8 13.46,44.68 20.03,44.68 20.03,37.87 14.05,37.87
WGND on Top Layer: 4.5,48.49 50.34,48.49 50.34,24.62 4.5,24.62
WGND on Bottom Layer: 5.39,48.49 50.34,48.49 50.34,24.94 5.39,24.94
$1N7036 on Top Layer: 41.99,29.78 43.43,29.78 43.43,26.77 41.99,26.77
$1N27675 on Top Layer: 8.69,27.91 12.83,27.91 12.83,24.74 8.69,24.74

## Text on the board
Top Layer: 更改线圈到通信的连线，现有连线方式无法正常通信 | 去除通信入MCU的100NF电容，这个电容会抑制高频方波 | 有条件可以换一个高速比较器 | 测试一下LI对应的MOS是否能正常打开 | 程序中应该加上一个平滑滤波和求平均值，避免频率变化太快引发问题 | 比较器应该单点接地，避免干扰 | 更换采样器件 | 减少线圈与其他电容电感的耦合 | ADC电压采样正常 | 现在需要再加上一个MOS了 | ADC电流采样正常
